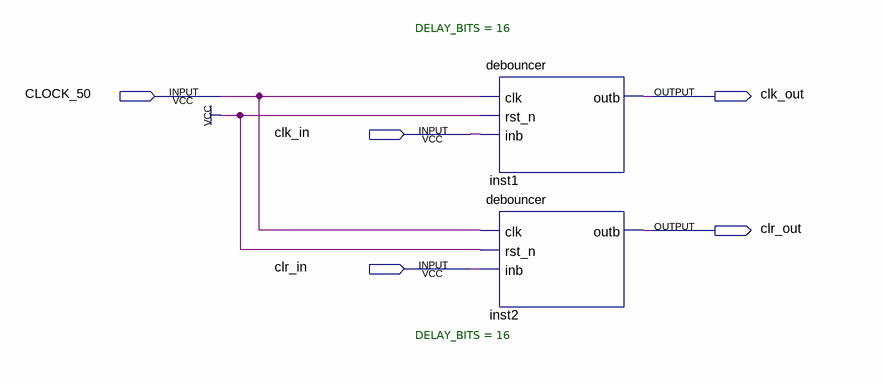
[diagram p0: schematic sheet]
// Quartus schematic clk_clr_debouncer.bdf as structural Verilog: 2 symbols, 5 pins
module clk_clr_debouncer (
  input  CLOCK_50,
  input  clk_in,
  input  clr_in,
  output clk_out,
  output clr_out
);

  debouncer #(.DELAY_BITS(16)) inst1 (.clk(CLOCK_50), .rst_n(1'b1), .inb(clk_in), .outb(clk_out));
  debouncer #(.DELAY_BITS(16)) inst2 (.clk(CLOCK_50), .rst_n(1'b1), .inb(clr_in), .outb(clr_out));
endmodule
